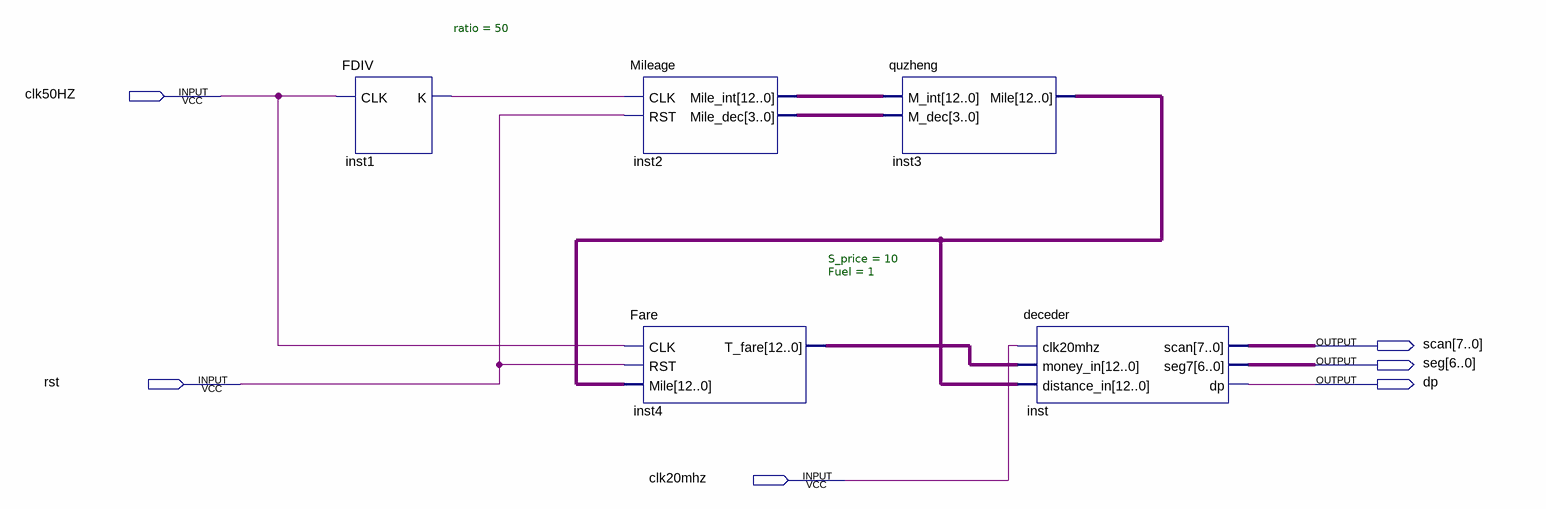
[diagram p0: schematic sheet]
// Quartus schematic chuzuche.bdf as structural Verilog: 5 symbols, 6 pins
module chuzuche (
  input  clk50HZ,
  input  rst,
  input  clk20mhz,
  output [7:0] scan,
  output [6:0] seg,
  output dp
);

  wire inst1_k;
  wire [3:0] inst2_mile_dec;
  wire [12:0] inst2_mile_int, inst3_mile, inst4_t_fare;

  FDIV #(.ratio(50)) inst1 (.CLK(clk50HZ), .K(inst1_k));
  Mileage inst2 (.CLK(inst1_k), .RST(rst), .Mile_int(inst2_mile_int), .Mile_dec(inst2_mile_dec));
  Fare #(.S_price(10), .Fuel(1)) inst4 (.CLK(clk50HZ), .RST(rst), .Mile(inst3_mile), .T_fare(inst4_t_fare));
  quzheng inst3 (.M_int(inst2_mile_int), .M_dec(inst2_mile_dec), .Mile(inst3_mile));
  deceder inst (
    .clk20mhz(clk20mhz), .money_in(inst4_t_fare), .distance_in(inst3_mile), .scan(scan), .seg7(seg), .dp(dp));
endmodule
